# EAGLE board 8_bit_Right_Rev_A (EAGLE 9.6.0)
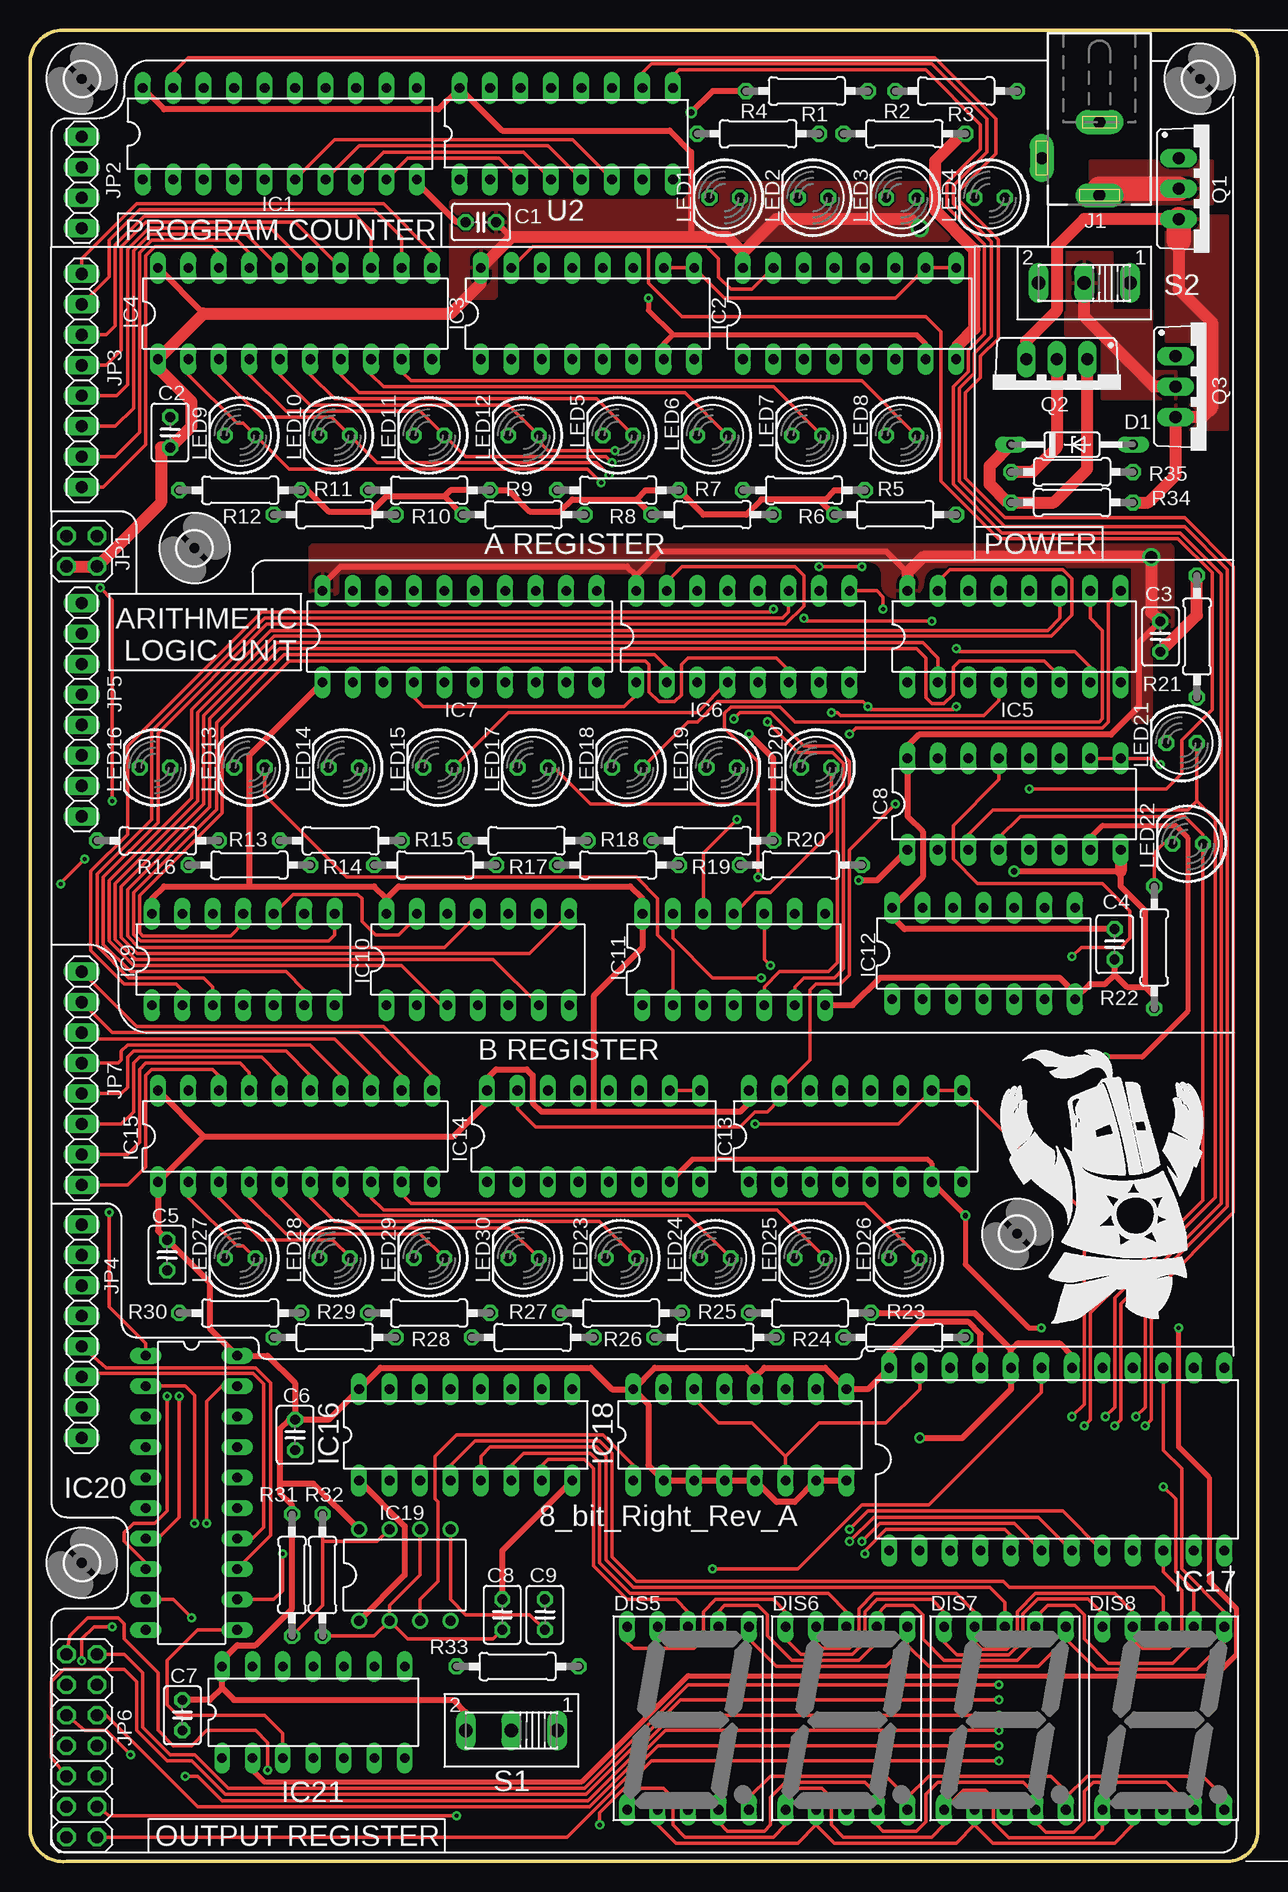
[diagram p6: board, top side]
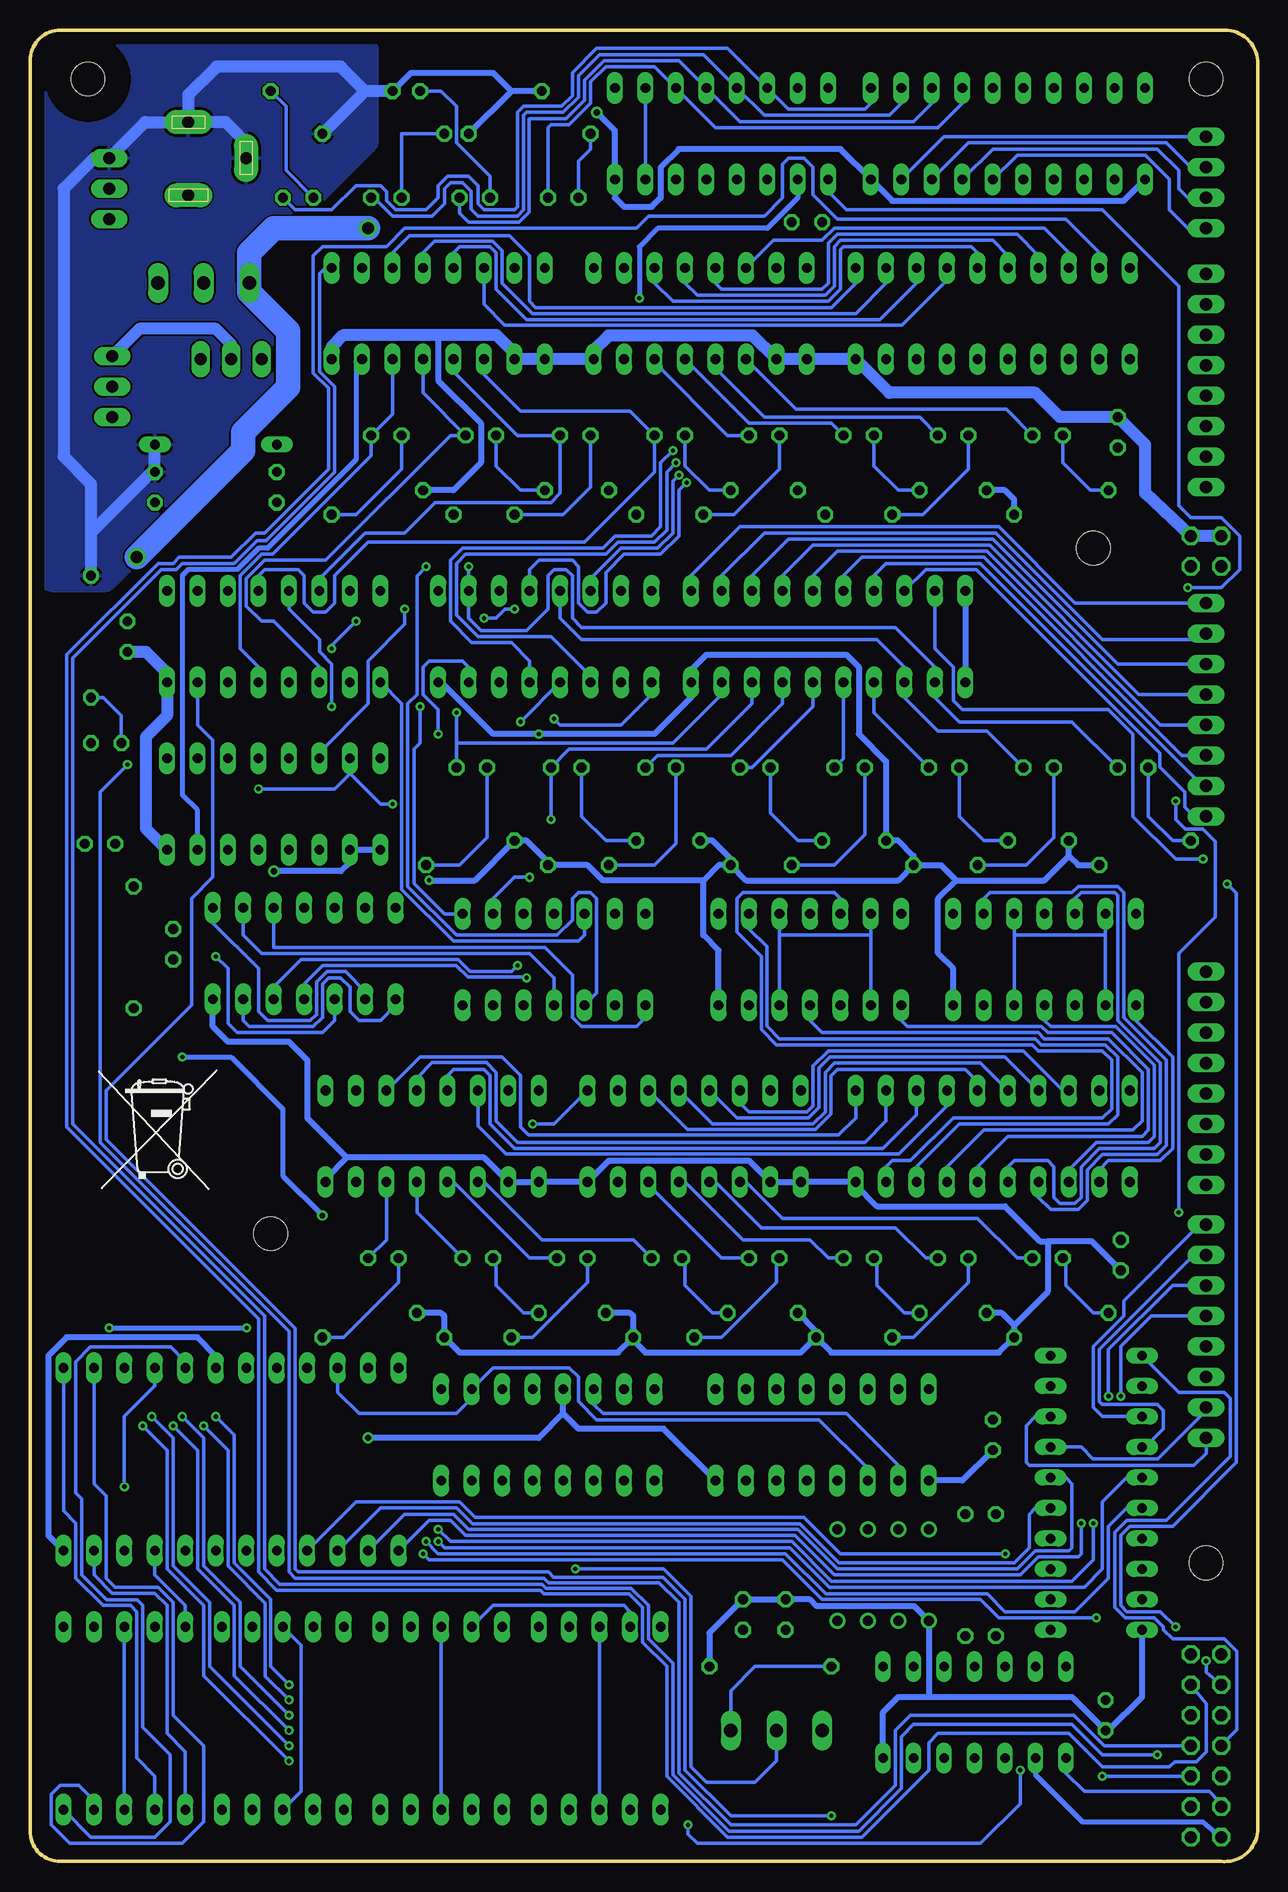
[diagram p7: board, bottom side, seen from below]

Size 102.36 x 152.68 mm. Coordinates in mm from the lower left corner, seen from the top.
Outline: 0,2.55 0,150.13 arc-90 3.05,152.67 99.82,152.67 arc-90 102.36,150.13 102.36,2.55 arc-90 99.82,0.01 3.05,0.01 arc-90 0,2.55
Copper layers (1*16): Top 0.035mm / dielectric 1.5mm / Bottom 0.035mm
Design rules "default": minimum track width 6mil, minimum drill 0.35mm, track to track 6mil, track to pad 6mil, pad to pad 6mil, via to via 6mil, smd to smd 6mil, copper to edge 40mil, drill to drill 6mil, minimum pad ring 10mil, minimum via ring 8mil, stop-mask expansion 4mil, vias tented up to drill 0mil, thermal gap 10mil

## Footprints (pad centres in the part's own frame; a part is rotated, then mirrored left to right if it is on the bottom)
C025-030X050 = drill 0.813 octagon: 1 -1.27,0; 2 1.27,0
DO35Z10 = drill 0.813 long: A 5.08,0; C -5.08,0
HDSP-M = drill 0.813 long: 1 -5.08,-7.62; 2 -2.54,-7.62; 3 0,-7.62; 4 2.54,-7.62; 5 5.08,-7.62; 6 5.08,7.62; 7 2.54,7.62; 8 0,7.62; 9 -2.54,7.62; 10 -5.08,7.62
2,8 = hole 2.8: 0,0
DIL20 = drill 0.813 long: 1 -11.43,-3.81; 2 -8.89,-3.81; 3 -6.35,-3.81; 4 -3.81,-3.81; 5 -1.27,-3.81; 6 1.27,-3.81; 7 3.81,-3.81; 8 6.35,-3.81; 9 8.89,-3.81; 10 11.43,-3.81; 11 11.43,3.81; 12 8.89,3.81; 13 6.35,3.81; 14 3.81,3.81; 15 1.27,3.81; 16 -1.27,3.81; 17 -3.81,3.81; 18 -6.35,3.81; 19 -8.89,3.81; 20 -11.43,3.81
DIL16 = drill 0.813 long: 1 -8.89,-3.81; 2 -6.35,-3.81; 3 -3.81,-3.81; 4 -1.27,-3.81; 5 1.27,-3.81; 6 3.81,-3.81; 7 6.35,-3.81; 8 8.89,-3.81; 9 8.89,3.81; 10 6.35,3.81; 11 3.81,3.81; 12 1.27,3.81; 13 -1.27,3.81; 14 -3.81,3.81; 15 -6.35,3.81; 16 -8.89,3.81
DIL14 = drill 0.813 long: 1 -7.62,-3.81; 2 -5.08,-3.81; 3 -2.54,-3.81; 4 0,-3.81; 5 2.54,-3.81; 6 5.08,-3.81; 7 7.62,-3.81; 8 7.62,3.81; 9 5.08,3.81; 10 2.54,3.81; 11 0,3.81; 12 -2.54,3.81; 13 -5.08,3.81; 14 -7.62,3.81
DIL24-6 = drill 0.813 long: 1 -13.97,-7.62; 2 -11.43,-7.62; 3 -8.89,-7.62; 4 -6.35,-7.62; 5 -3.81,-7.62; 6 -1.27,-7.62; 7 1.27,-7.62; 8 3.81,-7.62; 9 6.35,-7.62; 10 8.89,-7.62; 11 11.43,-7.62; 12 13.97,-7.62; 13 13.97,7.62; 14 11.43,7.62; 15 8.89,7.62; 16 6.35,7.62; 17 3.81,7.62; 18 1.27,7.62; 19 -1.27,7.62; 20 -3.81,7.62; 21 -6.35,7.62; 22 -8.89,7.62; 23 -11.43,7.62; 24 -13.97,7.62
DIL08 = drill 0.813 pad 1.27: 1 -3.81,-3.81; 2 -1.27,-3.81; 3 1.27,-3.81; 4 3.81,-3.81; 5 3.81,3.81; 6 1.27,3.81; 7 -1.27,3.81; 8 -3.81,3.81
DIL14' = drill 0.8 long: 1 -7.62,-3.81; 2 -5.08,-3.81; 3 -2.54,-3.81; 4 0,-3.81; 5 2.54,-3.81; 6 5.08,-3.81; 7 7.62,-3.81; 8 7.62,3.81; 9 5.08,3.81; 10 2.54,3.81; 11 0,3.81; 12 -2.54,3.81; 13 -5.08,3.81; 14 -7.62,3.81
DCJ0303 = drill 1 pad 2 long: 1 0,3.1; 2 4.8,0; 3 0,-3
2X02 = drill 1.016 octagon: 1 -1.27,-1.27; 2 -1.27,1.27; 3 1.27,-1.27; 4 1.27,1.27
1X04 = drill 1.016 long: 1 -3.81,0; 2 -1.27,0; 3 1.27,0; 4 3.81,0
1X08 = drill 1.016 long: 1 -8.89,0; 2 -6.35,0; 3 -3.81,0; 4 -1.27,0; 5 1.27,0; 6 3.81,0; 7 6.35,0; 8 8.89,0
2X07 = drill 1.016 octagon: 1 -7.62,-1.27; 2 -7.62,1.27; 3 -5.08,-1.27; 4 -5.08,1.27; 5 -2.54,-1.27; 6 -2.54,1.27; 7 0,-1.27; 8 0,1.27; 9 2.54,-1.27; 10 2.54,1.27; 11 5.08,-1.27; 12 5.08,1.27; 13 7.62,-1.27; 14 7.62,1.27
LED5MM = drill 0.813 octagon: A -1.27,0; K 1.27,0
TO220BV = drill 1.016 long: D 0,-2.54; G -2.54,-2.54; S 2.54,-2.54
0207/10 = drill 0.813 octagon: 1 -5.08,0; 2 5.08,0
255SB = drill 1.118 long: 1 -3.81,0; 2 0,0; 3 3.81,0

## Placement (x,y rotation side)
C1  0,1uF  [C025-030X050]  37.59,136.66 180 top
C2  0,1uF  [C025-030X050]  11.68,119.14 90 top
C3  0,1uF  [C025-030X050]  94.23,102.12 270 top
C4  0,1uF  [C025-030X050]  90.42,76.47 270 top
C5  0,1uF  [C025-030X050]  11.43,50.56 270 top
C6  0,1uF  [C025-030X050]  22.1,35.57 270 top
C7  0,1uF  [C025-030X050]  12.7,12.2 270 top
C8  0,01uF  [C025-030X050]  39.37,20.59 90 top
C9  0,01uF  [C025-030X050]  42.93,20.59 90 top
D1  BZX55  [DO35Z10]  86.87,118.12 0 top
DIS5  HD-H103  [HDSP-M]  54.86,11.95 0 top
DIS6  HD-H103  [HDSP-M]  68.07,11.95 0 top
DIS7  HD-H103  [HDSP-M]  81.28,11.95 0 top
DIS8  HD-H103  [HDSP-M]  94.49,11.95 0 top
H1  MOUNT-HOLE2.8  [2,8]  13.72,109.49 0 top
H2  MOUNT-HOLE2.8  [2,8]  82.3,52.34 0 top
H3  MOUNT-HOLE2.8  [2,8]  4.32,148.6 0 top
H5  MOUNT-HOLE2.8  [2,8]  4.32,24.9 0 top
H6  MOUNT-HOLE2.8  [2,8]  97.54,148.6 0 top
IC1  74LS245N  [DIL20]  20.83,144.03 0 top
IC2  74LS173N  [DIL16]  68.33,129.04 0 top
IC3  74LS173N  [DIL16]  46.48,129.04 0 top
IC4  74LS245N  [DIL20]  22.1,129.04 0 top
IC5  74S283N  [DIL16]  82.04,102.12 0 top
IC6  74S283N  [DIL16]  59.44,102.12 0 top
IC7  74LS245N  [DIL20]  35.81,102.12 0 top
IC8  74LS173N  [DIL16]  82.04,88.15 0 top
IC9  7486N  [DIL14]  17.78,75.2 0 top
IC10  7486N  [DIL14]  37.34,75.2 0 top
IC11  7402N  [DIL14]  58.67,75.2 0 top
IC12  74S08N  [DIL14]  79.5,75.7 0 top
IC13  74LS173N  [DIL16]  68.83,60.46 0 top
IC14  74LS173N  [DIL16]  46.99,60.46 0 top
IC15  74LS245N  [DIL20]  22.1,60.46 0 top
IC16  74LS139N  [DIL16]  36.32,35.57 0 top
IC17  28C16AP  [DIL24-6]  85.6,33.54 0 top
IC18  7476N  [DIL16]  59.18,35.57 0 top
IC19  LM555N  [DIL08]  31.24,23.89 0 top
IC20  74273N  [DIL20]  13.46,30.75 270 top
IC21  74LS08N  [DIL14']  23.62,12.46 0 top
J1  [DCJ0303]  89.15,142 180 top
JP1  [2X02]  4.32,109.23 90 top
JP2  [1X04]  4.32,139.97 270 top
JP3  [1X08]  4.32,123.46 270 top
JP4  [1X08]  4.32,44.21 270 top
JP5  [1X08]  4.32,96.02 270 top
JP6  [2X07]  4.32,9.66 90 top
JP7  [1X08]  4.32,65.29 270 top
LED1  GREEN  [LED5MM]  57.91,138.7 180 top
LED2  GREEN  [LED5MM]  65.28,138.7 180 top
LED3  GREEN  [LED5MM]  72.64,138.7 180 top
LED4  GREEN  [LED5MM]  80.01,138.7 180 top
LED5  RED  [LED5MM]  49.02,118.88 180 top
LED6  RED  [LED5MM]  56.9,118.88 180 top
LED7  RED  [LED5MM]  64.77,118.88 180 top
LED8  RED  [LED5MM]  72.64,118.88 180 top
LED9  RED  [LED5MM]  17.53,118.88 180 top
LED10  RED  [LED5MM]  25.4,118.88 180 top
LED11  RED  [LED5MM]  33.27,118.88 180 top
LED12  RED  [LED5MM]  41.15,118.88 180 top
LED13  RED  [LED5MM]  18.29,91.2 180 top
LED14  RED  [LED5MM]  26.16,91.2 180 top
LED15  RED  [LED5MM]  34.04,91.2 180 top
LED16  RED  [LED5MM]  10.41,91.2 180 top
LED17  RED  [LED5MM]  41.91,91.2 180 top
LED18  RED  [LED5MM]  49.78,91.2 180 top
LED19  RED  [LED5MM]  57.66,91.2 180 top
LED20  RED  [LED5MM]  65.53,91.2 180 top
LED21  GREEN  [LED5MM]  96.01,93.23 180 top
LED22  GREEN  [LED5MM]  96.52,84.85 180 top
LED23  RED  [LED5MM]  49.28,50.3 180 top
LED24  RED  [LED5MM]  57.15,50.3 180 top
LED25  RED  [LED5MM]  65.02,50.3 180 top
LED26  RED  [LED5MM]  72.9,50.3 180 top
LED27  RED  [LED5MM]  17.53,50.3 180 top
LED28  RED  [LED5MM]  25.4,50.3 180 top
LED29  RED  [LED5MM]  33.27,50.3 180 top
LED30  RED  [LED5MM]  41.15,50.3 180 top
Q1  IRF9530  [TO220BV]  98.3,139.46 270 top
Q2  IRF9530  [TO220BV]  85.6,122.69 180 top
Q3  IRF9530  [TO220BV]  98.04,122.95 270 top
R1  220  [0207/10]  64.77,147.59 180 top
R2  220  [0207/10]  72.9,144.03 0 top
R3  220  [0207/10]  77.22,147.59 180 top
R4  220  [0207/10]  60.71,144.03 0 top
R5  220  [0207/10]  72.14,112.28 0 top
R6  220  [0207/10]  64.52,114.31 180 top
R7  220  [0207/10]  56.9,112.28 0 top
R8  220  [0207/10]  49.02,114.31 180 top
R9  220  [0207/10]  41.15,112.28 0 top
R10  220  [0207/10]  33.27,114.31 180 top
R11  220  [0207/10]  25.4,112.28 0 top
R12  220  [0207/10]  17.53,114.31 180 top
R13  220  [0207/10]  18.29,83.07 180 top
R14  220  [0207/10]  25.91,85.1 0 top
R15  220  [0207/10]  33.78,83.07 180 top
R16  220  [0207/10]  10.67,85.1 0 top
R17  220  [0207/10]  41.4,85.1 0 top
R18  220  [0207/10]  49.02,83.07 180 top
R19  220  [0207/10]  56.9,85.1 0 top
R20  220  [0207/10]  64.26,83.07 180 top
R21  220  [0207/10]  97.28,102.12 90 top
R22  220  [0207/10]  93.73,76.21 270 top
R23  220  [0207/10]  72.9,43.7 0 top
R24  220  [0207/10]  65.02,45.73 180 top
R25  220  [0207/10]  57.15,43.7 0 top
R26  220  [0207/10]  49.28,45.73 180 top
R27  220  [0207/10]  41.91,43.7 0 top
R28  220  [0207/10]  33.27,45.73 180 top
R29  220  [0207/10]  25.4,43.7 0 top
R30  220  [0207/10]  17.53,45.73 180 top
R31  1k  [0207/10]  21.84,23.89 90 top
R32  100k  [0207/10]  24.38,23.89 90 top
R33  10k  [0207/10]  40.64,16.27 180 top
R34  220  [0207/10]  86.87,113.3 0 top
R35  1k  [0207/10]  86.87,115.84 180 top
S1  5 mm  [255SB]  40.13,10.93 180 top
S2  [255SB]  87.88,131.58 180 top
U2  74LS161N  [DIL16]  44.7,144.03 0 top
U$1  [SOLAIRE]  77.47,42.68 0 top
U$2  [MUELLTONNE_10.00]  97.28,55.64 0 bottom

## Tracks (layer width: path | path; a pad name or v marks a point on that pad's centre or on a via)
A_0
  Top 0.305: IC4.9 30.99,124.22 31.75,123.46 69.34,123.46 LED8.A
  Bottom 0.305: IC2.6 72.14,120.66 LED8.A 73.91,117.2 82.14,108.98 83.06,108.98 84.84,107.2 84.84,101.1 83.31,99.58 IC5.5
A_1
  Top 0.305: LED7.A 61.98,122.95 29.46,122.95 28.45,123.96 IC4.8
  Bottom 0.305: IC2.5 69.6,122.44 LED7.A 67.31,118.88 77.72,108.47 82.8,108.47 84.33,106.95 84.33,104.66 83.06,103.39 82.04,103.39 78.23,99.58 IC5.3
A_2
  Top 0.305: LED6.A 54.61,122.44 27.43,122.44 25.91,123.96 IC4.7
  Bottom 0.305: IC2.4 67.06,124.22 61.72,118.88 LED6.A 58.17,114.06 58.93,113.3 68.58,113.3 71.12,110.76 74.42,110.76 78.23,106.95 IC5.14
A_3
  Top 0.305: LED5.A 47.24,121.93 25.4,121.93 23.37,123.96 IC4.6
  Bottom 0.305: IC2.3 64.52,123.96 61.47,120.92 52.32,120.92 LED5.A 50.29,115.84 56.13,109.99 73.66,109.99 73.91,109.99 74.17,109.99 76.96,107.2 76.96,104.91 77.72,104.15 78.74,104.15 79.5,104.91 79.5,107.2 80.01,107.71 82.8,107.71 83.31,107.2 IC5.12
A_4  (via drill 0.35)
  Top 0.305: IC4.5 20.83,123.96 23.37,121.42 39.88,121.42 LED12.A 42.42,118.38 43.18,117.61 v48.77,117.61
  Bottom 0.305: IC3.6 50.29,124.98 44.2,118.88 LED12.A | IC6.5 60.71,100.09 62.23,101.61 65.53,101.61 67.31,103.39 67.31,108.47 66.29,109.49 54.61,109.49 53.59,110.5 50.55,110.5 49.78,111.26 49.78,116.6 v48.77,117.61
A_5  (via drill 0.35)
  Top 0.305: IC4.4 18.29,123.96 21.34,120.92 32.51,120.92 LED11.A 36.32,117.11 48.01,117.11 v48.51,116.6
  Bottom 0.305: IC3.5 42.42,119.9 35.56,119.9 LED11.A | IC6.3 55.63,98.82 58.93,102.12 65.02,102.12 66.8,103.9 66.8,108.22 66.04,108.98 54.36,108.98 53.34,109.99 50.29,109.99 49.28,111.01 49.28,115.84 v48.51,116.6
A_6  (via drill 0.35)
  Top 0.305: IC4.3 15.75,123.96 19.3,120.41 25.15,120.41 LED10.A 28.96,116.6 47.24,116.6 v48.26,115.58
  Bottom 0.305: IC3.4 45.21,124.47 41.15,120.41 28.19,120.41 LED10.A | IC6.14 55.63,106.95 53.09,109.49 50.04,109.49 48.77,110.76 48.77,115.07 v48.26,115.58
A_7  (via drill 0.35)
  Top 0.305: IC4.2 13.21,123.96 17.27,119.9 17.78,119.9 LED9.A 21.59,116.09 46.47,116.09 v47.62,114.94
  Bottom 0.305: LED9.A 20.98,121.07 38.5,121.07 IC3.3 | IC6.12 60.71,107.71 59.94,108.47 57.15,108.47 56.64,107.96 56.64,104.91 55.88,104.15 55.12,104.15 54.36,104.91 54.36,107.45 52.83,108.98 49.78,108.98 48.26,110.5 48.26,114.31 47.63,114.94 v47.62,114.94
A_BUS_0
  Top 0.305: IC4.11 33.53,134.12 29.46,138.19 8.89,138.19 4.32,133.62 JP3.1
  Bottom 0.305: IC4.11 33.53,131.58 35.56,129.55 60.2,129.55 60.71,130.06 60.71,133.86 62.39,135.55 70.71,135.55 72.14,134.12 IC2.11
A_BUS_1
  Top 0.305: IC4.12 30.99,135.39 28.7,137.68 9.14,137.68 6.6,135.14 6.6,132.13 JP3.2
  Bottom 0.305: IC2.12 69.6,134.12 68.63,135.09 63.8,135.09 62.99,134.28 62.99,131.58 60.45,129.04 33.53,129.04 30.99,131.58 IC4.12
A_BUS_2
  Top 0.305: JP3.3 6.35,127.27 7.11,128.03 7.11,134.77 9.51,137.17 27.18,137.17 28.45,135.9 IC4.13
  Bottom 0.305: IC4.13 28.45,131.58 31.5,128.54 60.96,128.54 63.5,131.08 63.5,134.12 64.01,134.63 66.55,134.63 67.06,134.12 IC2.13
A_BUS_3
  Top 0.305: IC4.14 22.1,136.66 9.65,136.66 7.62,134.63 7.62,126 6.35,124.73 JP3.4
  Bottom 0.305: IC4.14 25.91,131.84 29.67,128.08 62.79,128.08 64.52,129.81 IC2.14
A_BUS_4
  Top 0.305: JP3.5 7.21,122.19 8.13,123.1 8.13,134.4 9.88,136.16 20.07,136.16 IC4.15
  Bottom 0.305: IC4.15 23.37,134.12 23.88,134.63 34.54,134.63 34.8,134.38 34.8,131.08 35.81,130.06 48.77,130.06 50.29,131.58 IC3.11
A_BUS_5
  Top 0.305: IC4.16 18.03,135.65 10.02,135.65 8.64,134.26 8.64,121.17 7.11,119.65 JP3.6
  Bottom 0.305: IC4.16 20.83,133.87 22.1,135.14 34.8,135.14 35.31,134.63 35.31,131.33 36.07,130.57 46.74,130.57 47.75,131.58 IC3.12
A_BUS_6
  Top 0.305: JP3.7 7.11,117.11 9.14,119.14 9.14,134.12 10.16,135.14 17.27,135.14 18.29,134.12 IC4.17
  Bottom 0.305: IC4.17 18.29,133.87 20.07,135.65 35.05,135.65 35.81,134.89 35.81,131.58 36.32,131.08 44.7,131.08 45.21,131.58 IC3.13
A_BUS_7
  Top 0.305: IC4.18 15.75,134.12 15.24,134.63 10.41,134.63 9.65,133.87 9.65,118.12 6.1,114.57 JP3.8
  Bottom 0.305: IC4.18 15.75,134.12 17.78,136.16 35.31,136.16 36.32,135.14 40.39,135.14 IC3.14
ALU_BUS_0
  Bottom 0.305: IC7.11 47.24,107.2 43.18,111.26 21.59,111.26 15.24,104.91 JP5.1
ALU_BUS_1
  Bottom 0.305: IC7.12 44.7,107.2 41.15,110.76 21.84,110.76 12.95,101.87 4.83,101.87 JP5.2
ALU_BUS_2
  Bottom 0.305: JP5.3 11.68,99.83 22.1,110.25 39.12,110.25 42.16,107.2 IC7.13
ALU_BUS_3
  Bottom 0.305: IC7.14 39.62,107.2 37.08,109.74 22.35,109.74 9.91,97.29 JP5.4
ALU_BUS_4
  Bottom 0.305: IC7.15 37.08,107.2 35.05,109.23 22.61,109.23 8.13,94.75 JP5.5
ALU_BUS_5
  Bottom 0.305: IC7.16 34.54,107.2 33.02,108.72 22.86,108.72 6.35,92.21 JP5.6
ALU_BUS_6
  Bottom 0.305: IC7.17 32,107.2 30.99,108.22 23.11,108.22 4.57,89.67 JP5.7
ALU_BUS_7
  Bottom 0.305: IC7.18 27.69,107.71 23.48,107.71 8.18,92.4 8.18,91.25 6.1,89.17 6.1,87.9 5.33,87.13 JP5.8
B_0
  Top 0.305: IC15.9 30.99,55.64 31.75,54.88 69.6,54.88 LED26.A
  Bottom 0.305: IC13.6 72.64,51.83 LED26.A | IC15.9 30.99,57.92 30.48,58.43 28.96,58.43 25.4,61.99 12.95,61.99 12.19,62.75 12.19,66.81 12.95,67.58 18.29,67.58 18.8,68.08 40.13,68.08 41.4,69.35 41.4,75.45 43.43,77.48 43.43,80.28 42.93,80.78 35.31,80.78 34.8,80.28 IC10.12
B_1
  Top 0.305: LED25.A 62.28,54.32 29.46,54.32 28.45,55.33 IC15.8
  Bottom 0.305: IC13.5 70.1,54.11 LED25.A | IC15.8 28.45,57.92 24.89,61.48 12.45,61.48 11.68,62.24 11.68,67.07 12.7,68.08 18.03,68.08 18.54,68.59 39.88,68.59 40.95,69.66 40.95,76.26 42.42,77.74 IC10.9
B_2
  Top 0.305: LED24.A 54.86,53.86 27.43,53.86 25.91,55.38 IC15.7
  Bottom 0.305: IC13.4 67.06,56.65 60.71,50.3 LED24.A | IC15.7 25.91,57.92 22.86,60.97 10.41,60.97 9.65,61.73 9.65,65.8 12.45,68.59 17.78,68.59 18.29,69.1 36.32,69.1 37.34,70.12 IC10.4
B_3
  Top 0.305: LED23.A 47.5,53.35 25.4,53.35 23.37,55.38 IC15.6
  Bottom 0.305: IC13.3 64.52,56.65 59.69,51.83 52.07,51.83 LED23.A | IC15.6 23.37,57.92 20.83,60.46 9.65,60.46 9.14,60.97 9.14,66.05 12.19,69.1 17.53,69.1 18.03,69.61 29.21,69.61 29.72,70.12 IC10.1
B_4
  Top 0.305: LED30.A 39.88,52.84 23.37,52.84 20.83,55.38 IC15.5
  Bottom 0.305: IC14.6 50.8,56.4 44.7,50.3 LED30.A | IC9.12 15.24,80.28 14.73,80.78 11.94,80.78 11.68,80.53 11.68,70.12 8.13,66.56 8.13,59.96 8.64,59.45 13.21,59.45 14.73,57.92 14.73,55.38 15.24,54.88 16.51,54.88 17.02,55.38 17.02,57.92 17.53,58.43 20.32,58.43 20.83,57.92 IC15.5
B_5
  Top 0.305: LED29.A 32.51,52.34 21.34,52.34 18.29,55.38 IC15.4
  Bottom 0.305: IC14.5 47.75,56.65 42.93,51.83 37.34,51.83 35.81,50.3 LED29.A | IC15.4 18.29,55.38 17.27,54.37 14.99,54.37 14.22,55.13 14.22,57.67 12.95,58.94 8.38,58.94 7.62,59.7 7.62,66.81 11.18,70.37 11.18,80.78 11.68,81.29 14.99,81.29 15.49,80.78 22.35,80.78 22.86,80.28 IC9.9
B_6
  Top 0.305: LED28.A 26.67,50.4 25.24,51.83 19.3,51.83 15.75,55.38 IC15.3
  Bottom 0.305: IC14.4 45.21,56.65 41.4,52.84 30.23,52.84 27.69,50.3 LED28.A | IC15.3 15.75,57.67 13.46,59.96 9.14,59.96 8.64,60.46 8.64,66.42 11.82,69.61 17.27,69.61 17.78,70.12 IC9.4
B_7
  Top 0.305: LED27.A 17.78,51.32 17.27,51.32 13.21,55.38 IC15.2
  Bottom 0.305: IC14.3 42.67,56.65 39.62,53.61 23.37,53.61 20.07,50.3 LED27.A | IC9.1 10.16,70.12 7.11,67.07 7.11,59.45 8.13,58.43 12.45,58.43 13.21,57.67 IC15.2
B_BUS_0
  Top 0.305: IC15.11 33.53,65.54 29.46,69.61 8.89,69.61 JP7.1
  Bottom 0.305: IC15.11 33.53,61.99 34.95,60.57 60.81,60.57 61.47,61.23 61.47,65.54 62.99,67.07 69.85,67.07 IC13.11
B_BUS_1
  Top 0.305: IC15.12 30.99,65.54 27.43,69.1 6.86,69.1 JP7.2
  Bottom 0.305: IC13.12 70.1,65.34 68.83,66.61 64.31,66.61 63.5,65.8 63.5,61.73 61.72,59.96 32.77,59.96 30.99,61.73 IC15.12
B_BUS_2
  Top 0.305: IC15.13 28.45,65.54 25.4,68.59 5.08,68.59 JP7.3
  Bottom 0.305: IC15.13 28.45,62.24 31.24,59.45 61.98,59.45 64.01,61.48 64.01,65.54 64.52,66.05 67.06,66.05 67.56,65.54 IC13.13
B_BUS_3
  Top 0.305: IC15.14 25.91,65.54 23.37,68.08 8.13,68.08 7.62,67.58 7.62,66.81 7.37,66.56 JP7.4
  Bottom 0.305: IC15.14 25.91,63.01 29.93,58.99 62.67,58.99 65.02,61.34 IC13.14
B_BUS_4
  Top 0.305: IC15.15 23.37,65.54 21.34,67.58 8.64,67.58 8.13,67.07 8.13,64.53 7.62,64.02 JP7.5
  Bottom 0.305: IC15.15 23.37,65.04 24.38,66.05 35.05,66.05 35.61,65.49 35.61,62.31 36.9,61.02 47.54,61.02 IC14.11
B_BUS_5
  Top 0.305: IC15.16 20.83,65.54 19.3,67.07 9.14,67.07 8.64,66.56 8.64,62.5 7.62,61.48 JP7.6
  Bottom 0.305: IC15.16 23.11,66.56 35.31,66.56 36.07,65.8 36.07,62.5 37.08,61.48 45.47,61.48 IC14.12
B_BUS_6
  Top 0.305: IC15.17 18.29,65.8 17.53,66.56 9.65,66.56 9.14,66.05 9.14,59.96 8.13,58.94 JP7.7
  Bottom 0.305: IC15.17 21.08,67.07 35.68,67.07 36.58,66.17 36.58,62.86 37.45,61.99 43.43,61.99 IC14.13
B_BUS_7
  Top 0.305: IC15.18 15.75,65.54 15.24,66.05 10.16,66.05 9.65,65.54 9.65,57.92 8.13,56.4 JP7.8
  Bottom 0.305: IC14.14 43.18,63.26 42.42,62.5 37.59,62.5 37.08,63 37.08,66.31 35.81,67.58 19.56,67.58 16.26,64.27 IC15.18
CE  (via drill 0.35)
  Top 0.305: U2.10 51.05,149.11 51.82,149.87 75.18,149.87 79.76,145.3 79.76,142.51 76.96,139.71 76.96,138.19 80.14,135.01 80.14,127.14 78.74,125.74 78.74,124.08 77.47,122.81 77.47,115.07 81.28,111.26 96.27,111.26 99.82,107.71 99.82,54.62 92.96,47.76 92.96,37.86 v92.2,37.1 | v80.77,9.66 52.37,9.66 44.75,2.04 JP6.1
  Bottom 0.305: U2.10 U2.7 | v92.2,37.1 90.42,35.32 90.42,24.65 87.38,21.6 87.38,16.27 v80.77,9.66
CF  (via drill 0.35)
  Top 0.305: IC8.3 78.23,85.61 80.26,87.64 96.52,87.64 97.28,88.4 | 97.28,88.4 LED21.A | 97.28,88.4 98.81,86.88 98.81,55.38 90.42,47 90.42,37.86 v89.66,37.1 | v80.77,12.2 53.62,12.2 46.51,5.09 16,5.09 13.97,7.12 v12.95,7.12
  Bottom 0.305: v89.66,37.1 87.88,35.32 87.88,24.65 84.84,21.6 84.84,16.27 v80.77,12.2 | v12.95,7.12 JP6.5
CLK  (via drill 0.35, 0.45)
  Top 0.406: IC2.7 74.68,126.5 73.91,127.27 53.59,127.27 | v51.56,130.31 51.56,129.3 53.59,127.27 | 53.59,127.27 52.83,126.5 IC3.7 | IC8.7 88.39,85.36 89.41,86.37 95.5,86.37 96.52,85.36 96.52,70.88 92.71,67.07 v89.66,67.07 | IC14.7 55.22,58.53 74.83,58.53 75.18,58.18 IC13.7 v77.98,53.86 77.98,49.8 83.29,44.48 v84.3,44.48 | IC21.2 18.54,7.63 19.56,6.62 45.97,6.62 54.86,15.51 98.81,15.51 100.58,17.28 100.58,21.09 98.3,23.38 98.3,32.02 95.76,34.56 v95.76,44.48
  Bottom 0.406: U2.2 38.35,138.7 40.89,136.16 50.04,136.16 51.56,134.63 v51.56,130.31 | IC2.7 74.93,125.23 75.18,124.98 75.18,116.85 82.55,109.49 83.31,109.49 85.09,107.71 89.15,107.71 89.66,107.2 89.66,88.91 88.39,87.64 IC8.7 | JP6.2 4.57,3.31 14.63,3.31 18.54,7.23 IC21.2 | v89.66,67.07 85.6,67.07 81.28,62.75 81.28,57.16 v77.98,53.86 | v95.76,44.48 v84.3,44.48
CLR  (via drill 0.35)
  Top 0.305: IC3.15 41.91,134.63 51.56,134.63 | IC2.15 60.2,131.08 58.42,131.08 57.4,132.09 57.4,133.62 56.39,134.63 51.56,134.63 | IC14.15 40.64,62.75 42.16,61.23 59.18,61.23 60.45,62.5 61.47,62.5 62.48,63.51 IC13.15 65.02,66.81 65.02,72.66 65.53,73.16 67.56,73.16 68.33,73.93 68.33,84.34 v72.14,88.15 | v83.31,89.42 94.74,89.42 96.01,90.69 96.01,93.48 98.55,96.02 98.55,107.45 95.71,110.3 80.72,110.3 75.95,115.07 75.95,127.52 74.68,128.79 54.36,128.79 51.56,131.58 51.56,134.63
  Bottom 0.305: v83.31,89.42 76.96,89.42 75.69,90.69 | 75.69,90.69 IC8.15 | 75.69,90.69 73.15,88.15 v72.14,88.15
GND  (via drill 0.35, 0.5, 0.55)
  Top 0.508: v55.12,145.81 56.9,147.59 R1.2 | IC16.1 31.24,27.95 31.24,23.89 IC19.1 | IC16.8 39.37,25.92 C8.2 | R5.1 65.79,113.55 | 65.79,113.55 66.29,113.55 67.06,114.31 R6.1 | 65.79,113.55 60.96,113.55 59.69,112.28 56.13,112.28 R8.1 51.31,114.31 50.55,113.55 | 34.54,113.8 R9.1 | R12.1 23.11,114.31 24.89,112.53 28.45,112.53 29.72,113.8 34.54,113.8 | R7.1 50.55,113.55 | 50.55,113.55 45.21,113.55 44.2,112.53 41.66,112.53 39.88,114.31 R10.1 35.05,114.31 34.54,113.8 | R19.2 61.98,91.96 v59.94,93.99 | IC11.7 68.58,71.39 70.87,73.67 85.85,73.67 87.12,72.4 IC12.7 88.39,73.16 89.66,73.16 90.42,73.93 | 90.42,73.93 C4.2 | 90.42,73.93 91.44,72.91 92.96,72.91 | 92.96,72.91 93.73,72.15 R22.2 | 92.96,72.91 92.96,79.26 90.93,81.29 90.93,82.56 v82.04,82.56 | 77.34,126.38 77.22,126.25 IC2.8 | IC8.1 70.61,81.8 v69.09,81.8 | v74.17,35.32 77.72,35.32 81.79,39.38 IC17.20 81.79,42.68 | R24.1 78.74,45.73 81.79,42.68 | IC17.18 86.87,42.18 85.85,43.19 82.3,43.19 81.79,42.68 | C1.2 35.56,136.66 32.26,139.97 IC1.10
  Top 1.016: 77.34,126.38 78.74,127.77 78.74,134.38 75.44,137.68 75.44,141.74 77.72,144.03 R2.2 | C3.2 97.28,103.9 R21.2 | IC8.8 90.93,82.56
  Bottom 0.508: 74.68,147.33 74.42,147.59 | R1.2 62.23,147.59 | R3.2 70.61,149.11 63.75,149.11 62.23,147.59 | R4.2 62.23,147.59 | IC1.1 11.18,138.44 30.48,138.44 IC1.10 34.8,142.76 48.26,142.76 49.78,141.24 49.78,138.7 50.55,137.93 52.83,137.93 53.59,138.7 U2.8 53.59,144.28 v55.12,145.81 | R11.1 20.32,113.55 21.08,114.31 R12.1 | R18.2 43.94,83.58 45.47,85.1 R17.2 | R15.2 28.7,83.83 29.97,85.1 R14.2 30.99,91.71 33.27,93.99 33.27,99.58 34.29,100.6 45.97,100.6 47.24,99.33 IC7.10 47.24,97.04 50.29,93.99 v59.94,93.99 63.75,93.99 68.07,98.31 IC6.8 | R18.2 42.67,81.8 29.97,81.8 R15.2 | R15.2 26.42,83.07 25.15,81.8 | 15.75,83.83 17.78,81.8 25.15,81.8 | R13.2 14.99,83.07 15.75,83.83 | 15.75,83.83 R16.2 | IC8.1 IC8.2 75.69,83.32 76.45,82.56 v82.04,82.56 | IC9.7 25.4,74.43 26.67,75.7 26.67,80.28 25.15,81.8 | IC10.7 44.96,75.96 46.23,77.23 46.23,81.8 | 46.23,81.8 44.96,83.07 R18.2 | R24.1 68.07,45.73 67.82,45.48 R23.1 66.55,42.43 53.34,42.43 R25.1 | R25.1 52.07,45.48 52.32,45.73 R26.1 | R25.1 52.07,43.45 51.05,42.43 38.1,42.43 R27.1 | R27.1 36.83,44.21 R28.1 | R27.1 35.56,42.43 21.59,42.43 R29.1 20.32,44.72 | 20.32,44.72 21.34,45.73 R30.1 | IC13.8 77.72,56.91 75.95,58.69 | 75.95,58.69 64.52,58.69 IC13.2 IC13.1 IC14.8 54.1,58.43 42.42,58.43 IC14.2 IC14.1 IC15.10 33.53,56.4 31.75,54.62 21.08,54.62 18.16,51.7 17.53,51.7 | 20.32,44.72 17.53,47.51 17.53,51.7 | R33.1 45.72,19.06 C9.2 C8.2 37.34,21.86 36.78,21.3 28.65,21.3 IC19.1 27.43,13.73 | C6.2 24.64,31.76 IC16.1 | IC17.18 86.87,42.18 88.39,43.7 99.31,43.7 100.84,42.18 100.84,27.19 IC17.12 | 27.43,13.73 15.49,13.73 C7.2 12.45,10.93 9.65,13.73 IC20.10
  Bottom 0.508: IC16.8 49.53,36.08 56.64,36.08 57.91,37.35 | 57.91,37.35 IC18.13 | 46.23,81.8 54.61,81.8 55.88,83.07 R20.2 59.18,83.32 60.96,85.1 R19.2 65.28,81.8 v69.09,81.8 | C5.2 13.84,51.7 17.53,51.7 | IC12.7 87.12,69.61 85.85,68.34 80.77,68.34 79.25,66.81 79.25,61.99 75.95,58.69 | v74.17,35.32 59.94,35.32 57.91,37.35 | 27.43,13.73 29.97,13.73 31.24,12.46 IC21.7 | R6.1 67.06,114.31 64.77,116.6 64.77,119.9 68.33,123.46 68.33,127.27
  Bottom 1.016: R3.2 | R3.2 74.42,147.59 76.45,149.62 86.82,149.62 89.15,147.28 J1.3 | 74.68,147.33 R2.2 | IC2.8 77.22,126.25 76.2,127.27 68.33,127.27 63.5,127.27 61.98,125.74 IC2.2 IC2.1 IC3.8 55.37,126 54.15,127.21 42.11,127.21 IC3.2 IC3.1 IC4.10 30.73,122.44 18.54,122.44 16.51,120.41 C2.2 9.4,118.12 9.4,114.06 JP1.3 JP1.4 | C3.2 92.71,100.85 90.93,99.07 IC5.8 90.93,95.52 92.71,93.74 92.71,86.12 IC8.8 | 97.28,110.76 R21.2 | 97.28,110.76 92.2,115.84 R35.1 D1.A | J1.2 84.58,142.23 84.58,143.52 86.06,145 J1.3 | J1.3 92.76,145 Q1.G 97.03,142 99.57,139.46 99.57,117.13 97.28,114.84 97.28,110.76
  pour Bottom: 93.73,107.96 95.39,106.3 arc45 96.28,105.93 100.33,105.93 arc90 101.6,107.2 101.6,150.89 arc90 100.33,152.16 83.06,152.16 74.68,152.16 arc90 73.41,150.89 73.41,143.54 arc45 73.78,142.64 79.5,136.92 79.5,120.66 79.5,109.23 arc90 80.77,107.96
GND1
  Bottom 0.305: R5.2 75.18,112.28 71.37,116.09 LED8.K
GND2
  Bottom 0.305: R6.2 61.47,114.31 63.5,116.34 LED7.K
GND3
  Bottom 0.305: R7.2 57.91,112.28 55.63,114.57 LED6.K
GND4
  Bottom 0.305: R8.2 45.72,114.31 47.75,116.34 LED5.K
GND5
  Bottom 0.305: R9.2 43.69,112.28 39.88,116.09 LED12.K
GND6
  Bottom 0.305: R10.2 29.97,114.31 32,116.34 LED11.K
GND7
  Bottom 0.305: R11.2 27.94,112.28 24.13,116.09 LED10.K
GND8
  Bottom 0.305: R12.2 13.97,114.31 16.26,116.6 LED9.K
GND9
  Bottom 0.305: R23.2 76.2,43.7 71.63,48.27 LED26.K
GND10
  Bottom 0.305: R24.2 61.21,45.73 63.5,48.02 63.5,50.05 LED25.K
GND11
  Bottom 0.305: R25.2 60.45,43.7 55.88,48.27 LED24.K
GND12
  Bottom 0.305: R26.2 45.47,45.73 47.75,48.02 47.75,50.05 LED23.K
GND13
  Bottom 0.305: R27.2 44.7,43.7 40.13,48.27 40.13,50.05 LED30.K
GND14
  Bottom 0.305: R28.2 29.46,45.73 31.75,48.02 31.75,50.05 LED29.K
GND15
  Bottom 0.305: R29.2 28.7,43.7 24.13,48.27 LED28.K
GND16
  Bottom 0.305: R30.2 13.72,45.73 16,48.02 16,50.05 LED27.K
N$1
  Bottom 0.305: R4.1 55.63,142.76 56.64,141.74 LED1.K
N$2
  Bottom 0.305: LED2.K 64.01,140.47 66.8,143.27 66.8,146.32 68.07,147.59 R1.1
N$3
  Bottom 0.305: R2.1 71.37,144.03 LED3.K
N$4
  Bottom 0.305: R3.1 81.03,146.32 81.03,140.98 LED4.K
N$5
  Bottom 0.305: IC1.11 32.26,146.57 32.77,146.06 39.12,146.06 U2.14 44.2,151.14 55.12,151.14 57.15,149.11 57.15,147.22 58.05,146.32 61.21,146.32 61.72,145.81 61.72,137.93 61.98,137.68 64.52,137.68 65.02,138.19 65.02,139.71 65.79,140.47 67.56,140.47 68.33,139.71 68.33,138.7 69.34,137.68 71.88,137.68 72.64,138.44 72.64,139.2 73.15,139.71 75.18,139.71 77.22,137.68 80.26,137.68 LED4.A
N$6
  Bottom 0.305: IC1.12 29.72,146.57 30.73,145.55 41.15,145.55 U2.13 46.23,150.63 54.86,150.63 56.64,148.86 56.64,147.08 57.91,145.81 60.96,145.81 61.21,145.55 61.21,137.68 61.72,137.17 65.02,137.17 65.58,137.73 65.58,139.25 66.29,139.97 67.31,139.97 67.82,139.46 67.82,138.19 68.83,137.17 72.14,137.17 73.66,138.7 LED3.A
N$7
  Bottom 0.305: IC1.13 27.18,146.57 28.7,145.05 43.18,145.05 U2.12 48.26,150.13 54.5,150.13 56.13,148.49 56.13,146.82 57.66,145.3 60.71,145.3 60.76,145.25 60.76,137.49 61.58,136.66 65.79,136.66 66.55,137.43 LED2.A
N$8
  Bottom 0.305: IC1.14 24.64,146.57 26.67,144.54 45.21,144.54 U2.11 50.29,149.62 54.36,149.62 55.63,148.35 55.63,146.57 57.4,144.79 58.93,144.79 59.18,144.54 LED1.A
N$9  (via drill 0.35)
  Top 0.305: IC5.9 89.92,104.91 89.92,95.01 89.41,94.5 68.83,94.5 v68.33,93.99
  Bottom 0.305: v68.33,93.99 68.33,96.02 69.6,97.29 69.6,99.58 69.09,100.09 66.29,100.09 65.79,99.58 IC6.7
N$10
  Top 0.305: IC6.11 63.25,104.15 62.74,103.64 19.56,103.64 10.16,94.25 10.16,86.88 5.59,82.31 5.59,76.33 8.24,73.67 14.48,73.67 15.24,72.91 IC9.3
N$11
  Top 0.305: IC9.6 22.86,72.66 21.34,74.18 8.38,74.18 6.1,76.47 6.1,82.05 10.67,86.63 10.67,94.09 19.72,103.14 62.99,103.14 64.52,104.66 64.52,107.2 63.75,107.96 54.36,107.96 53.09,106.69 IC6.15
N$12
  Top 0.305: IC9.8 25.4,77.23 24.89,76.72 9.21,76.72 8.64,77.29 8.64,80.78 15.55,87.69 15.55,94.94 21.2,100.6 52.07,100.6 53.09,99.58 IC6.2
N$13
  Top 0.305: IC9.11 17.78,78.24 16.71,77.18 9.4,77.18 9.14,77.43 9.14,80.53 16,87.39 16,94.5 21.59,100.09 51.31,100.09 51.61,99.78 51.61,97.5 52.43,96.68 53.74,96.68 54.3,97.25 54.3,99.78 54.86,100.34 62.23,100.34 63.25,99.33 IC6.6
N$14
  Top 0.305: IC10.3 34.29,71.39 30.99,74.69 8.65,74.69 6.6,76.74 6.6,81.8 13.46,88.66 13.46,96.02 20.07,102.63 84.84,102.63 85.85,103.64 IC5.11
N$15
  Top 0.305: IC10.6 38.61,75.2 8.79,75.2 7.11,76.88 7.11,81.55 13.97,88.4 13.97,95.77 20.37,102.17 85.14,102.17 86.87,103.9 86.87,106.95 86.11,107.71 76.71,107.71 75.69,106.69 IC5.15
N$16
  Top 0.305: IC10.8 41.66,75.7 8.93,75.7 7.62,77.01 7.62,81.29 14.48,88.15 14.48,95.52 20.57,101.61 74.42,101.61 75.69,100.34 IC5.2
N$17
  Top 0.305: IC10.11 34.54,76.21 9.07,76.21 8.13,77.15 8.13,81.04 14.99,87.9 14.99,95.26 20.83,101.1 73.91,101.1 74.68,100.34 74.68,97.04 75.18,96.53 76.2,96.53 76.96,97.29 76.96,99.58 77.47,100.09 84.58,100.09 85.85,98.82 IC5.6
N$18
  Bottom 0.305: R13.1 19.3,83.07 17.02,85.36 LED13.K
N$19
  Bottom 0.305: R14.1 22.86,85.1 24.89,87.13 LED14.K
N$20
  Bottom 0.305: R15.1 35.31,83.07 32.77,85.61 LED15.K
N$21
  Bottom 0.305: R16.1 7.11,85.1 9.14,87.13 LED16.K
N$22
  Bottom 0.305: R17.1 38.35,85.1 40.64,87.39 LED17.K
N$23
  Bottom 0.305: R18.1 50.29,83.07 48.51,84.85 LED18.K
N$24
  Bottom 0.305: R19.1 54.36,85.1 56.39,87.13 LED19.K
N$25
  Bottom 0.305: R20.1 66.55,83.07 64.26,85.36 LED20.K
N$26  (via drill 0.35)
  Top 0.305: v65.79,107.94 65.81,107.96 69.36,107.96 v69.34,107.94
  Bottom 0.305: LED16.A 15.49,95.01 24.89,95.01 26.92,97.04 IC7.2 26.92,99.58 30.23,102.88 56.39,102.88 57.15,103.64 57.15,107.2 57.66,107.71 58.67,107.71 59.18,107.2 59.18,104.41 60.96,102.63 64.77,102.63 65.79,103.64 IC6.10 v65.79,107.94 | IC11.3 55.12,72.4 55.12,80.28 55.63,80.78 56.64,80.78 57.15,80.28 57.15,78.5 58.42,77.23 66.8,77.23 70.87,81.29 70.87,96.53 70.1,97.29 70.1,107.18 v69.34,107.94
N$27
  Top 0.305: LED13.A 19.56,88.91 26.42,82.05 50.55,82.05 52.32,80.28 52.32,77.23 53.59,75.96 IC11.2
  Bottom 0.305: LED13.A 22.61,94.25 26.67,94.25 29.46,97.04 IC7.3 29.46,99.58 31.75,101.87 56.39,101.87 58.17,103.64 IC6.13
N$28  (via drill 0.35)
  Top 0.305: IC7.4 32,97.04 32.77,96.28 49.53,96.28 50.55,97.29 IC6.1 | v58.67,95.26 59.18,95.77 61.72,95.77 64.52,92.98 67.06,92.98 68.33,91.71 68.33,89.53 67.82,89.03 67.82,74.43 67.06,73.67 64.52,73.67 63.75,72.91 IC11.6
  Bottom 0.305: IC7.4 32,95.77 LED14.A | v58.67,95.26 58.17,94.75 53.09,94.75 50.55,97.29 IC6.1
N$29  (via drill 0.35)
  Top 0.305: LED15.A 39.88,95.77 55.63,95.77 IC6.4 | v61.47,95.01 64.01,92.47 66.9,92.47 67.82,91.55 67.82,89.67 67.31,89.17 67.31,74.94 66.55,74.18 62.48,74.18 61.21,72.91 IC11.5
  Bottom 0.305: IC7.5 34.54,91.96 LED15.A | v61.47,95.01 IC6.4
N$30  (via drill 0.35)
  Top 0.305: LED17.A 43.69,91.2 46.74,88.15 60.71,88.15 | v60.71,82.05 60.71,88.15 | IC5.10 88.39,103.64 89.41,102.63 89.41,95.26 89.15,95.01 63.75,95.01 62.54,96.23 58.42,96.23 57.91,95.72 57.91,94.5 60.71,91.71 60.71,88.15
  Bottom 0.305: IC7.6 37.08,96.28 42.16,91.2 LED17.A | IC11.9 63.75,80.28 61.98,82.05 v60.71,82.05
N$31  (via drill 0.35)
  Top 0.305: LED18.A 54.86,95.01 55.63,95.01 57.3,96.68 69.44,96.68 v69.85,96.28 70.1,96.02 76.96,96.02 v77.22,96.28
  Bottom 0.305: IC7.7 39.62,96.53 43.94,92.21 50.04,92.21 LED18.A | IC11.8 67.82,79.01 70.36,81.55 70.36,92.72 69.85,93.23 v69.85,96.28 | IC5.13 80.77,104.41 78.23,101.87 78.23,100.85 77.22,99.83 v77.22,96.28
N$32  (via drill 0.35)
  Top 0.305: v58.93,86.88 56.13,84.09 IC11.12
  Bottom 0.305: IC7.8 42.16,96.53 45.97,92.72 57.4,92.72 LED19.A v58.93,86.88 | IC11.12 56.13,77.23 56.64,76.72 67.06,76.72 71.37,81.04 71.37,96.53 IC5.1
N$33  (via drill 0.35)
  Top 0.305: IC5.4 80.77,96.79 79.5,95.52 67.56,95.52 67.31,95.77 v66.8,95.77 | LED20.A 66.8,85.86 61.72,80.78 60.45,80.78 IC11.11
  Bottom 0.305: IC7.9 44.7,97.29 48.77,93.23 66.8,93.23 | 66.8,93.23 LED20.A | v66.8,95.77 66.8,93.23
N$34
  Bottom 0.305: IC12.10 82.04,76.21 59.44,76.21 57.15,73.93 57.15,70.37 56.39,69.61 51.82,69.61 51.05,70.37 IC11.1
N$35
  Bottom 0.305: IC12.9 84.58,77.23 83.06,75.7 60.71,75.7 58.67,73.67 IC11.4
N$36  (via drill 0.35)
  Top 0.305: v61.72,74.69 61.21,75.2 IC11.10
  Bottom 0.305: IC12.5 82.04,72.91 79.76,75.2 66.69,75.2 65.67,74.18 62.23,74.18 v61.72,74.69
N$37  (via drill 0.35)
  Top 0.305: v60.96,73.67 56.9,73.67 53.59,76.97 IC11.13
  Bottom 0.305: IC12.4 79.5,73.16 77.98,74.69 66.82,74.69 65.86,73.72 61.01,73.72 v60.96,73.67
N$38
  Bottom 0.305: IC12.6 84.58,70.12 84.07,69.61 78.74,69.61 77.98,70.37 77.98,73.16 77.47,73.67 76.45,73.67 75.69,72.91 75.69,70.88 74.93,70.12 73.15,70.12 71.88,71.39 IC12.1
N$39
  Bottom 0.305: IC12.8 87.12,78.24 83.31,74.43 83.31,70.88 82.55,70.12 78.99,70.12 78.49,70.62 78.49,73.3 77.61,74.18 76.06,74.18 74.42,72.54 IC12.2
N$40  (via drill 0.35)
  Top 0.305: IC8.13 80.77,90.18 76.96,86.37 76.96,83.58 78.99,81.55 89.41,81.55 91.69,79.26 91.69,76.97 90.93,76.21 87.63,76.21 v86.87,75.45
  Bottom 0.305: v86.87,75.45 85.85,74.43 85.85,69.86 85.09,69.1 77.98,69.1 76.96,70.12 IC12.3
N$41  (via drill 0.35)
  Top 0.305: v71.12,104.41 71.12,105.42 70.61,105.93 IC6.9
  Bottom 0.305: IC8.14 78.23,92.47 74.17,96.53 74.17,100.09 71.12,103.14 v71.12,104.41
N$42
  Bottom 0.305: LED21.K 94.74,95.52 96.27,97.04 R21.1
N$43
  Top 0.305: LED22.K 94.49,84.85 93.73,84.09 R22.1
N$44
  Top 1.016: R34.2 93.22,113.3 95.5,115.58 Q3.S 97.79,120.41 98.55,121.17 98.55,128.28 95.76,131.08 95.76,135.14 | Q2.S 83.06,126.76 85.6,129.3 85.6,134.63 87.88,136.92 Q1.S
  Top 2.032: Q1.S 95.76,135.14
  pour Top: 95.5,119.39 99.82,119.39 99.82,137.17 94.74,137.17 94.74,126.76 97.79,126.76 97.79,121.42 95.5,121.42
N$45  (via drill 0.35)
  Top 0.305: v68.33,27.7 69.85,29.22 86.11,29.22 IC17.8 | v13.72,28.21 13.72,38.87 12.95,39.64 IC20.2
  Bottom 0.305: v68.33,27.7 67.31,26.68 38.86,26.68 35.56,23.38 15.49,23.38 13.72,25.16 v13.72,28.21
N$46  (via drill 0.35)
  Top 0.305: v68.33,26.68 70.36,28.71 84.07,28.71 IC17.7
  Bottom 0.305: v68.33,26.68 67.82,26.17 39,26.17 35.7,22.87 14.48,22.87 12.95,24.4 12.95,29.98 10.92,32.02 IC20.5
N$47
  Top 1.016: D1.C 80.01,116.34 80.01,114.82 81.53,113.3 R34.1 85.34,113.3 88.14,116.09 Q2.G
N$48
  Top 1.016: Q3.D 93.73,122.95 87.88,128.79 S2.2
  pour Top: 86.36,134.12 86.36,127.27 89.41,127.27 89.41,121.93 95.5,121.93 95.5,124.22 93.47,124.22 93.47,129.3 90.17,129.3 90.17,134.12
N$49
  Top 1.016: Q2.D 85.6,117.87 83.57,115.84 R35.2
  Bottom 1.016: Q2.D 85.6,126.5 86.87,127.77 93.22,127.77 Q3.G
N$72  (via drill 0.35)
  Top 0.305: v69.34,26.68 70.87,28.21 82.04,28.21 IC17.6
  Bottom 0.305: v69.34,26.68 68.33,25.67 39.37,25.67 36.02,22.31 22.55,22.31 21.08,20.84 15.24,20.84 12.45,23.63 12.45,27.95 10.92,29.48 IC20.6
N$75  (via drill 0.35)
  Top 0.305: v69.6,25.67 69.6,25.92 71.37,27.7 81.28,27.7 81.79,27.19 IC17.5 | v13.46,20.33 11.94,21.86 IC20.9
  Bottom 0.305: v69.6,25.67 69.09,25.16 39.62,25.16 36.32,21.86 23.11,21.86 21.59,20.33 v13.46,20.33
N$76  (via drill 0.35)
  Top 0.305: IC20.12 20.32,21.86 21.06,22.59 v21.06,25.66 v21.06,25.67
  Bottom 0.305: IC17.4 75.18,29.98 66.55,29.98 65.28,28.71 37.85,28.71 34.8,25.67 v21.06,25.67
N$78
  Bottom 0.305: IC17.3 73.15,29.48 66.8,29.48 65.48,28.15 38.16,28.15 34.91,24.9 20.32,24.9 19.05,26.17 19.05,28.97 18.54,29.48 IC20.15
N$79
  Bottom 0.305: IC17.2 71.12,28.97 67.06,28.97 65.79,27.7 38.35,27.7 35.05,24.4 20.07,24.4 18.54,25.92 15.75,25.92 15.49,26.17 15.49,31.51 16,32.02 IC20.16
N$80  (via drill 0.35)
  Top 0.305: IC20.19 16,39.64 14.73,38.37 v14.73,28.21
  Bottom 0.305: IC17.1 69.09,28.46 67.31,28.46 66.04,27.19 38.61,27.19 35.31,23.89 19.81,23.89 18.29,25.41 14.99,25.41 14.73,25.67 v14.73,28.21
N$81
  Top 0.305: DIS8.5 99.57,5.35 97.79,7.12 88.14,7.12 86.36,5.35 DIS7.5 86.36,5.85 85.09,7.12 74.93,7.12 73.15,5.35 | DIS6.5 73.15,5.35 | 73.15,5.35 71.37,7.12 61.72,7.12 59.94,5.35 DIS5.5
  Bottom 0.305: IC17.17 89.41,41.67 90.63,42.89 97.33,42.89 98.55,41.67 98.55,30.75 98.04,30.24 98.04,23.89 95.96,21.8 93.42,21.8 92.96,21.35 92.96,11.19 90.68,8.9 90.68,3.31 91.95,2.04 97.28,2.04 DIS8.5
N$82  (via drill 0.35)
  Top 0.305: DIS5.7 57.4,20.84 57.91,21.35 60.71,21.35 61.47,20.59 61.47,18.81 63.5,16.78 69.09,16.78 70.61,18.3 DIS6.7 70.61,20.59 71.37,21.35 73.66,21.35 74.42,20.59 74.42,18.55 76.2,16.78 82.3,16.78 83.82,18.3 DIS7.7 83.82,20.33 84.84,21.35 87.12,21.35 87.88,20.59 87.88,18.55 89.92,16.52 95.25,16.52 97.03,18.3 DIS8.7 97.03,22.62 95.5,24.14 95.5,30.24 v94.49,31.25
  Bottom 0.305: v94.49,31.25 94.49,37.1 91.95,39.64 IC17.16
N$83
  Top 0.305: 86.36,18.55 88.9,16.01 97.28,16.01 99.57,18.3 DIS8.6 99.57,20.84 96.01,24.4 96.01,32.78 94.49,34.3 IC17.15 | DIS7.6 86.36,18.55 | 86.36,18.55 84.07,16.27 74.93,16.27 73.15,18.05 | 73.15,18.05 DIS6.6 | 73.15,18.05 71.37,16.27 62.23,16.27 59.94,18.55 DIS5.6
N$84
  Top 0.305: DIS8.4 94.74,6.62 88.65,6.62 87.88,5.85 87.88,3.32 87.01,2.45 84.68,2.45 83.82,3.31 DIS7.4 83.82,5.6 82.8,6.62 75.69,6.62 74.68,5.6 74.68,3.31 73.91,2.55 71.12,2.55 70.61,3.06 DIS6.4 70.61,5.6 69.6,6.62 62.99,6.62 61.72,5.35 61.72,3.06 61.21,2.55 58.17,2.55 57.4,3.31 DIS5.4
  Bottom 0.305: DIS8.4 97.03,5.09 98.3,6.36 99.82,6.36 100.58,5.6 100.58,3.06 99.06,1.54 89.66,1.54 87.88,3.31 87.88,9.66 90.42,12.2 90.42,21.6 91.69,22.87 95.25,22.87 96.01,23.63 96.01,30.49 97.03,31.51 IC17.14
N$85
  Top 0.305: DIS8.2 91.95,3.06 90.42,1.54 80.26,1.54 78.74,3.06 | DIS7.2 78.74,3.06 | 78.74,3.06 77.22,1.54 67.06,1.54 65.53,3.06 | DIS6.2 65.53,3.06 | 65.53,3.06 64.01,1.54 53.85,1.54 52.32,3.06 DIS5.2
  Bottom 0.305: IC17.13 99.57,29.22 98.55,28.21 98.55,23.63 96.27,21.35 93.98,21.35 93.47,20.84 93.47,8.65 91.95,7.12 DIS8.2
N$86
  Top 0.305: DIS8.1 89.41,2.67 88.73,1.99 81.59,1.99 80.31,3.27 80.31,5.29 79.65,5.96 77.83,5.96 DIS7.1 76.2,3.06 75.18,2.04 67.82,2.04 66.8,3.06 66.8,5.35 66.04,6.11 63.75,6.11 62.99,5.35 DIS6.1 62.99,3.06 61.98,2.04 54.61,2.04 53.59,3.06 53.59,5.35 52.83,6.11 50.29,6.11 49.78,5.6 DIS5.1
  Bottom 0.305: DIS8.1 89.41,9.16 90.93,10.68 90.93,21.35 91.95,22.36 95.5,22.36 97.03,23.89 IC17.11
N$87
  Top 0.305: DIS6.9 65.53,18.3 66.04,17.79 68.33,17.79 69.09,18.55 69.09,21.09 70.36,22.36 77.22,22.36 78.74,20.84 DIS7.9 78.74,18.31 79.36,17.69 81.43,17.69 82.3,18.56 82.3,20.84 83.82,22.36 90.42,22.36 91.95,20.84 DIS8.9 91.95,18.55 92.71,17.79 95,17.79 96.01,18.81 96.01,22.62 94.49,24.14 IC17.10
  Bottom 0.305: DIS6.9 63.75,21.35 52.83,21.35 52.32,20.84 DIS5.9
N$88
  Top 0.305: DIS8.10 89.41,20.7 88.2,21.91 84.01,21.91 82.75,20.65 82.75,18.37 81.61,17.23 77.27,17.23 76.2,18.31 DIS7.10 76.2,20.84 75.18,21.86 70.61,21.86 69.6,20.84 69.6,18.3 68.58,17.28 64.26,17.28 62.99,18.55 DIS6.10 62.99,20.84 61.98,21.86 57.15,21.86 56.13,20.84 56.13,18.55 55.37,17.79 50.29,17.79 49.78,18.3 DIS5.10
  Bottom 0.305: IC17.9 91.95,23.89 89.41,21.35 DIS8.10
N$89
  Top 0.305: DIS5.8 54.86,20.84 53.85,21.86 49.78,21.86 46.99,24.65 46.99,32.78 46.23,33.54 43.18,33.54 42.67,33.03 IC16.7
  Bottom 0.305: DIS5.3 DIS5.8
N$90
  Top 0.305: DIS6.8 68.07,20.84 66.55,22.36 50.04,22.36 47.5,24.9 47.5,33.29 46.74,34.05 41.15,34.05 40.13,33.03 IC16.6
  Bottom 0.305: DIS6.3 DIS6.8
N$91
  Top 0.305: IC16.5 37.59,33.79 38.35,34.56 47.24,34.56 48.01,33.79 48.01,25.16 50.29,22.87 80.01,22.87 81.28,21.6 DIS7.8
  Bottom 0.305: DIS7.3 79.76,5.85 79.76,18.05 DIS7.8
N$92
  Top 0.305: IC16.4 35.05,33.03 37.08,35.06 47.5,35.06 48.51,34.05 48.51,25.41 50.55,23.38 81.13,23.38 81.64,22.87 93.73,22.87 94.49,22.11 DIS8.8
  Bottom 0.305: DIS8.3 DIS8.8
N$93
  Bottom 0.305: IC16.3 32.51,32.78 36.58,36.84 55.12,36.84 56.64,38.37 56.64,40.4 57.4,41.16 63.75,41.16 IC18.10 65.53,38.62 66.8,37.35 74.93,37.35 76.71,39.13 IC17.22
N$94
  Top 0.305: IC18.6 62.99,33.79 | 62.99,33.79 65.79,36.59 71.37,36.59 74.17,39.38 IC17.23 | IC18.14 55.37,38.62 57.4,36.59 60.2,36.59 62.99,33.79
  Bottom 0.305: IC16.2 29.97,33.03 34.29,37.35 54.61,37.35 55.37,38.11 IC18.14
N$95
  Top 0.305: IC19.3 32.51,21.86 34.04,23.38 34.04,29.98 33.78,30.24 33.78,33.79 35.56,35.57 47.75,35.57 50.29,33.03 IC18.1
N$96
  Top 0.305: R31.1 24.38,21.35 24.38,26.68 | 24.38,26.68 28.96,26.68 IC19.7 | 24.38,26.68 R32.2
N$97
  Top 0.305: R32.1 28.7,18.81 IC19.2 | IC19.2 29.97,21.35 32.51,23.89 IC19.6 | IC19.2 31.5,18.55 38.61,18.55 C8.1
N$98
  Top 0.305: IC19.5 35.05,21.86 36.32,20.59 41.66,20.59 C9.1
N$99
  Top 0.305: IC21.3 21.08,10.68 19.56,12.2 12.32,12.2 11.43,13.09 11.43,16.78 13.97,19.32 IC20.11
N$100  (via drill 0.35)
  Top 0.305: v56.9,24.4 64.01,24.4 69.34,29.73 74.93,29.73 84.33,39.13 IC17.19
  Bottom 0.305: v56.9,24.4 49.53,24.4 47.24,22.11 47.24,7.89 45.97,6.62 41.91,6.62 40.13,8.39 S1.2
N$101
  Bottom 0.305: R33.2 41.91,16.27 43.94,14.24 S1.1
N_AI  (via drill 0.35)
  Top 0.305: IC3.10 IC3.9 57.91,130.31 72.14,130.31 IC2.10 IC2.9 | v8.38,8.9 6.35,10.93 4.57,10.93 JP6.10
  Bottom 0.305: IC2.9 77.72,132.85 78.23,132.35 78.23,124.22 76.96,122.95 76.96,115.84 82.68,110.12 83.44,110.12 85.34,108.22 89.66,108.22 90.17,107.71 91.44,107.71 98.81,100.34 98.81,61.48 82.8,45.48 82.8,24.4 81.53,23.13 59.66,23.13 59.34,22.8 52.25,22.8 50.8,21.35 50.8,18.55 48.77,16.52 48.77,7.24 44.08,2.55 33.27,2.55 29.72,6.11 29.72,10.43 28.7,11.44 15.49,11.44 12.95,8.9 v8.38,8.9
N_AO
  Bottom 0.305: IC4.19 13.21,134.12 16,136.92 35.05,136.92 37.08,138.95 37.08,141.24 37.85,142 39.12,142 39.62,141.49 39.62,138.7 41.15,137.17 50.8,137.17 51.82,136.16 71.12,136.16 72.64,134.63 77.98,134.63 78.74,133.87 78.74,124.08 77.47,122.81 77.47,116.09 82.8,110.76 83.57,110.76 85.6,108.72 89.92,108.72 90.42,108.22 91.69,108.22 99.31,100.6 99.31,61.23 83.31,45.22 83.31,24.14 81.79,22.62 59.8,22.62 59.53,22.34 52.44,22.34 51.31,21.21 51.31,18.3 49.28,16.27 49.28,7.1 44.22,2.04 33.02,2.04 27.43,7.63 27.43,9.92 26.67,10.68 15.75,10.68 12.95,7.89 7.37,7.89 6.91,8.34 5.15,8.34 4.32,9.17 4.32,13.16 JP6.11
N_BI  (via drill 0.35)
  Top 0.305: v60.45,61.48 72.39,61.48 IC13.10 IC13.9 87.88,54.11 87.88,38.11 v86.87,37.1 | IC14.9 IC14.10 | v80.77,14.74 54.86,14.74 46.23,6.11 16.51,6.11 13.72,8.9 11.68,8.9 9.4,11.19 9.4,15.76 7.87,17.28 JP6.13
  Bottom 0.305: v60.45,61.48 58.67,61.48 IC14.9 | v86.87,37.1 85.34,35.57 85.34,24.9 82.3,21.86 82.3,16.27 v80.77,14.74
N_CLR  (via drill 0.35)
  Top 0.305: v6.6,54.11 6.6,46.24 9.65,43.19 IC20.1 | v5.84,106.18 6.86,105.17 v6.86,88.4
  Bottom 0.305: v6.6,54.11 6.6,75.7 3.56,78.75 3.56,85.05 4.57,86.07 6.04,86.07 6.86,86.88 v6.86,88.4 | U2.1 35.81,139.2 34.29,137.68 12.95,137.68 6.6,131.33 6.6,113.04 5.59,112.03 3.05,112.03 1.52,110.5 1.52,107.71 3.05,106.18 v5.84,106.18 | IC20.1 6.6,39.13 2.79,39.13 2.29,38.62 2.29,33.79 7.62,28.46 10.92,28.46 11.94,27.44 11.94,21.21 11.06,20.33 8.64,20.33 7.87,19.57 7.87,19.32 7.11,18.55 2.79,18.55 1.78,17.54 1.78,10.98 3.1,9.66 JP6.8
N_CO  (via drill 0.35)
  Top 0.305: IC1.19 11.94,149.11 13.21,150.38 75.44,150.38 80.52,145.3 80.52,142.37 77.47,139.32 77.47,138.44 80.72,135.19 80.72,126.96 79.25,125.49 79.25,123.71 77.98,122.44 77.98,115.33 81.28,112.03 96.27,112.03 100.33,107.96 100.33,54.11 93.47,47.26 93.47,36.84 v92.96,36.33 | v80.77,8.39 51.82,8.39 47.5,4.08 v47.5,3.06 | JP6.14 3.3,18.81 4.83,20.33 7.37,20.33 7.87,19.82 7.87,18.55 10.67,15.76 10.67,10.93 11.94,9.66 13.46,9.66 14.73,10.93 18.8,10.93 19.81,9.92 v19.81,7.63
  Bottom 0.305: v92.96,36.33 90.93,34.3 90.93,24.4 87.88,21.35 87.88,15.51 v80.77,8.39 | v47.5,3.06 47.5,2.3 46.74,1.54 23.11,1.54 19.81,4.84 v19.81,7.63
N_EO  (via drill 0.35)
  Top 0.305: v6.86,19.57 5.33,19.57 4.32,18.55 v4.32,16.73 | v4.57,83.58 2.56,81.57 v2.56,81.49
  Bottom 0.305: IC7.19 26.92,101.1 25.4,99.58 25.4,96.79 24.64,96.02 12.45,96.02 10.41,93.99 10.41,87.13 6.86,83.58 v4.57,83.58 | JP6.12 4.32,15.8 v4.32,16.73 | v2.56,81.49 1.8,80.73 1.8,33.26 7.11,27.95 10.67,27.95 11.43,27.19 11.43,21.35 10.92,20.84 8.13,20.84 v6.86,19.57
N_FI  (via drill 0.35)
  Top 0.305: IC8.10 IC8.9 93.73,91.96 v94.23,91.45
  Bottom 0.305: v94.23,91.45 96.52,89.17 96.52,59.96 80.77,44.21 80.77,24.14 80.26,23.63 59.52,23.63 59.15,23.26 49.91,23.26 48.26,21.6 48.26,7.38 43.94,3.06 33.53,3.06 30.23,6.36 30.23,10.93 28.96,12.2 15.34,12.2 12.8,9.66 JP6.7
N_J  (via drill 0.35)
  Top 0.305: U2.9 53.59,148.86 54.1,149.36 74.68,149.36 79.25,144.79 79.25,142.76 76.45,139.97 76.45,137.93 79.55,134.83 79.55,127.32 78.23,126 78.23,124.22 76.96,122.95 76.96,114.82 81.03,110.76 95.9,110.76 99.31,107.34 99.31,54.88 90.93,46.49 90.93,36.84 v90.42,36.33 | v80.77,10.93 52.99,10.93 46.64,4.58 13.97,4.58 6.35,12.2 JP6.9
  Bottom 0.305: v90.42,36.33 88.39,34.3 88.39,24.4 85.34,21.35 85.34,15.51 v80.77,10.93
OI
  Bottom 0.305: JP6.4 3.3,5.09 4.06,5.85 14.48,5.85 16,7.38 IC21.1
OUT_BUS_0
  Bottom 0.305: JP4.1 4.83,53.1 11.18,46.75 11.18,45.48 13.72,42.94 13.72,37.86 12.95,37.1 IC20.3
OUT_BUS_1
  Bottom 0.305: IC20.4 9.4,34.56 7.87,36.08 7.87,37.6 8.38,38.11 12.95,38.11 13.21,38.37 13.21,42.68 5.33,50.56 JP4.2
OUT_BUS_2  (via drill 0.35)
  Top 0.305: IC20.7 10.67,26.94 12.45,28.71 v12.45,38.79
  Bottom 0.305: v12.45,38.79 12.45,42.68 7.11,48.02 JP4.3
OUT_BUS_3  (via drill 0.35)
  Top 0.305: IC20.8 9.65,24.9 7.87,26.68 7.87,27.44 8.64,28.21 10.41,28.21 11.43,29.22 v11.43,38.79
  Bottom 0.305: JP4.4 8.89,45.48 11.43,42.94 v11.43,38.79
OUT_BUS_4
  Top 0.305: IC20.13 20.07,27.19 20.07,39.89 18.8,41.16 6.35,41.16 JP4.5
OUT_BUS_5
  Top 0.305: IC20.14 18.54,26.94 19.49,27.88 19.49,39.82 18.61,40.7 4.88,40.7 JP4.6
OUT_BUS_6
  Bottom 0.305: JP4.7 4.32,37.6 8.33,33.59 13.77,33.59 14.73,34.56 IC20.17
OUT_BUS_7
  Bottom 0.305: IC20.18 18.54,37.1 19.3,36.33 19.3,33.29 19.05,33.03 5.33,33.03 4.32,34.05 JP4.8
PC_BUS_0
  Top 0.305: IC1.9 31.5,142 39.12,142 U2.3
  Bottom 0.305: IC1.9 26.16,143.78 JP2.1
PC_BUS_1
  Top 0.305: U2.4 41.15,142.51 29.46,142.51 IC1.8
  Bottom 0.305: IC1.8 24.13,143.27 7.62,143.27 5.59,141.24 JP2.2
PC_BUS_2
  Top 0.305: IC1.7 27.43,143.01 43.18,143.01 U2.5
  Bottom 0.305: IC1.7 22.1,142.76 8.38,142.76 6.6,140.98 6.6,139.46 5.84,138.7 JP2.3
PC_BUS_3
  Top 0.305: U2.6 45.21,143.52 25.4,143.52 IC1.6
  Bottom 0.305: IC1.6 20.07,142.25 9.4,142.25 7.37,140.22 7.37,137.68 5.84,136.16 JP2.4
SU  (via drill 0.35)
  Top 0.305: IC10.13 32.26,78.75 30.73,77.23 28.8,77.23 27.69,78.35 27.69,80.28 27.33,80.63 21.95,80.63 IC9.10 | v75.18,103.39 64.77,103.39 v64.52,103.64 | v77.22,101.1 77.47,100.85 87.12,100.85 88.39,99.58 IC5.7 | v61.98,104.41 61.72,104.15 19.3,104.15 8.13,92.98 8.13,85.61 5.08,82.56 5.08,75.96 7.87,73.16 12.19,73.16 12.7,72.66 IC9.2 | v35.56,3.82 6.6,3.82 JP6.3
  Bottom 0.305: IC10.5 39.88,77.23 | 39.88,77.23 IC10.10 | IC9.2 IC9.13 12.7,77.23 20.32,77.23 | IC9.10 20.32,77.23 | 20.32,77.23 IC9.5 | IC10.13 32.26,77.23 | 32.26,77.23 IC10.2 | v61.98,104.41 62.74,104.41 63.5,103.64 v64.52,103.64 | v77.22,101.1 77.22,101.36 v75.18,103.39 | 32.26,77.23 39.88,77.23 | IC5.7 88.39,94.75 87.12,93.48 87.12,82.05 88.9,80.28 88.9,71.39 96.01,64.27 96.01,60.21 80.26,44.46 80.26,24.4 80.01,24.14 59.13,24.14 58.7,23.71 49.61,23.71 47.75,21.86 47.75,7.63 43.94,3.82 v35.56,3.82
VCC  (via drill 1)
  Top 0.508: IC1.20 11.18,146.06 34.04,146.06 U2.16 39.37,144.28 53.34,144.28 55.12,142.51 55.12,135.44 | IC4.20 14.48,129.04 | IC7.20 24.38,106.44 25.91,107.96 49.78,107.96 50.55,107.2 | 50.55,107.2 52.58,109.23 71.37,109.23 73.15,107.45 | IC6.16 50.55,107.2 | 73.15,107.2 IC5.16 | IC9.14 10.16,80.28 11.18,81.29 18.29,81.29 | 29.72,80.28 28.7,81.29 18.29,81.29 | C4.1 72.9,77.74 71.88,78.75 IC12.14 74.42,82.05 74.42,85.86 73.15,87.13 IC8.16 73.15,92.98 74.12,93.94 90.12,93.94 92.46,96.28 92.46,101.61 C3.1 | IC7.1 18.29,92.21 18.29,81.29 | IC13.16 59.94,63.26 59.18,62.5 46.99,62.5 | IC15.20 14.48,60.46 | 14.48,60.46 IC15.1 10.67,52.59 C5.1 14.99,48.27 14.99,44.46 IC20.20 19.81,42.18 22.1,39.89 C6.1 | C7.1 14.99,13.47 16,14.49 | 16,14.49 IC21.14 16,16.78 17.27,18.05 18.8,18.05 21.84,21.09 R31.2 21.84,29.73 20.83,30.75 20.83,31.51 | C6.1 24.89,36.84 IC16.16 29.21,41.16 46.74,41.16 48.51,39.38 IC18.16 | C6.1 21.59,36.84 20.83,36.08 20.83,31.51 | 16,14.49 17.02,13.47 35.31,13.47 36.32,12.46 S1.3 | IC19.8 23.62,31.51 20.83,31.51 | IC18.16 51.56,38.11 51.56,33.03 IC18.2 IC18.3 IC18.4 IC18.5 62.23,29.98 63.75,29.98 IC18.7 IC18.8 | IC18.16 52.07,41.16 59.69,41.16 60.45,40.4 | IC18.12 60.45,40.4 | 60.45,40.4 61.21,41.16 66.29,41.16 IC18.9 69.85,39.38 IC17.24 71.63,42.43 74.17,44.97 78.23,44.97 79.25,43.95 IC17.21 | IC10.14 29.72,80.28 | 29.72,80.28 30.73,81.29 50.04,81.29 51.05,80.28 IC11.14 51.05,76.21 46.99,72.15 46.99,62.5 | 46.99,62.5 42.67,62.5 41.91,63.26 41.91,65.54 41.4,66.05 38.86,66.05 38.1,65.29 IC14.16 38.1,63.26 35.31,60.46 14.48,60.46 | C1.1 40.08,135.44 40.18,135.44
  Top 1.016: JP1.2 JP1.1 10.92,113.3 10.92,117.87 C2.1 13.46,119.65 13.46,121.68 10.67,124.47 IC4.1 14.48,129.04 35.05,129.04 37.59,131.58 IC3.16 40.18,135.44 55.12,135.44 58.12,135.44 59.44,134.12 | IC2.16 59.44,134.12 | 59.44,134.12 62.23,136.92 73.41,136.92 v74.17,136.16 | C3.1 93.47,104.15 v93.47,108.72 74.42,108.72 73.15,107.45 73.15,107.2
  Bottom 0.508: IC7.20 IC7.1
  Bottom 2.032: v93.47,108.72 84.58,117.61 84.58,119.14 80.82,122.9 80.82,127.57 84.07,130.82 S2.3 84.07,134.12 82.04,136.16 v74.17,136.16
  pour Top: 75.69,139.97 56.09,139.97 arc45 55.91,139.89 54.54,138.52 arc-45 54.36,138.44 35.31,138.44 arc90 35.05,138.19 35.05,130.57 arc90 35.31,130.31 38.61,130.31 arc90 38.86,130.57 38.86,134.89 arc-90 39.12,135.14 76.35,135.14 arc45 76.53,135.21 77.22,135.9 75.95,137.17 75.95,139.71 arc90
  pour Top: 95.25,102.37 95.25,109.49 arc90 95,109.74 23.62,109.74 arc90 23.37,109.49 23.37,105.93 arc90 23.62,105.68 25.4,105.68 arc90 25.65,105.93 25.65,107.2 arc-90 25.91,107.45 52.58,107.45 arc90 52.83,107.71 52.83,108.22 arc-90 53.09,108.47 69.85,108.47 arc-90 71.12,107.2 71.12,106.44 arc90 72.14,105.42 73.15,105.42 arc90 74.42,106.69 arc-90 75.69,107.96 91.69,107.96 arc-90 91.95,107.71 91.95,95.26 arc90 92.2,95.01 92.96,95.01 arc90 93.47,95.52 93.47,102.37
VDD
  Top 2.032: J1.1 89.15,139.46 Q1.D
  pour Top: 88.39,141.74 88.39,138.19 98.55,138.19 98.55,141.74
ZF  (via drill 0.35)
  Top 0.305: IC8.4 80.77,85.36 82.55,87.13 96.27,87.13 97.79,85.61 LED22.A 97.79,55.13 88.39,45.73 88.39,36.84 v87.88,36.33 | v80.77,13.47 54.24,13.47 46.37,5.6 16.26,5.6 13.46,8.39 11.43,8.39 8.89,10.93 8.89,15 7.87,16.01 2.79,16.01 1.78,15 1.78,8.71 JP6.6
  Bottom 0.305: v87.88,36.33 85.85,34.3 85.85,24.65 82.75,21.55 82.75,15.45 v80.77,13.47

## Text on the board
tPlace: PROGRAM COUNTER | A REGISTER | POWER | ARITHMETIC / LOGIC UNIT | B REGISTER | OUTPUT REGISTER